# EasyEDA schematic SCH_Data Logging system Schematic Rev 1.0_2023-01-20.json

## Sheets
1 Sheet_1: TITLE: Sheet_1; REV: 1.0; Date: 2023-01-20; Sheet: 1/1; Drawn By: nicaltwasser; Company: Your Company
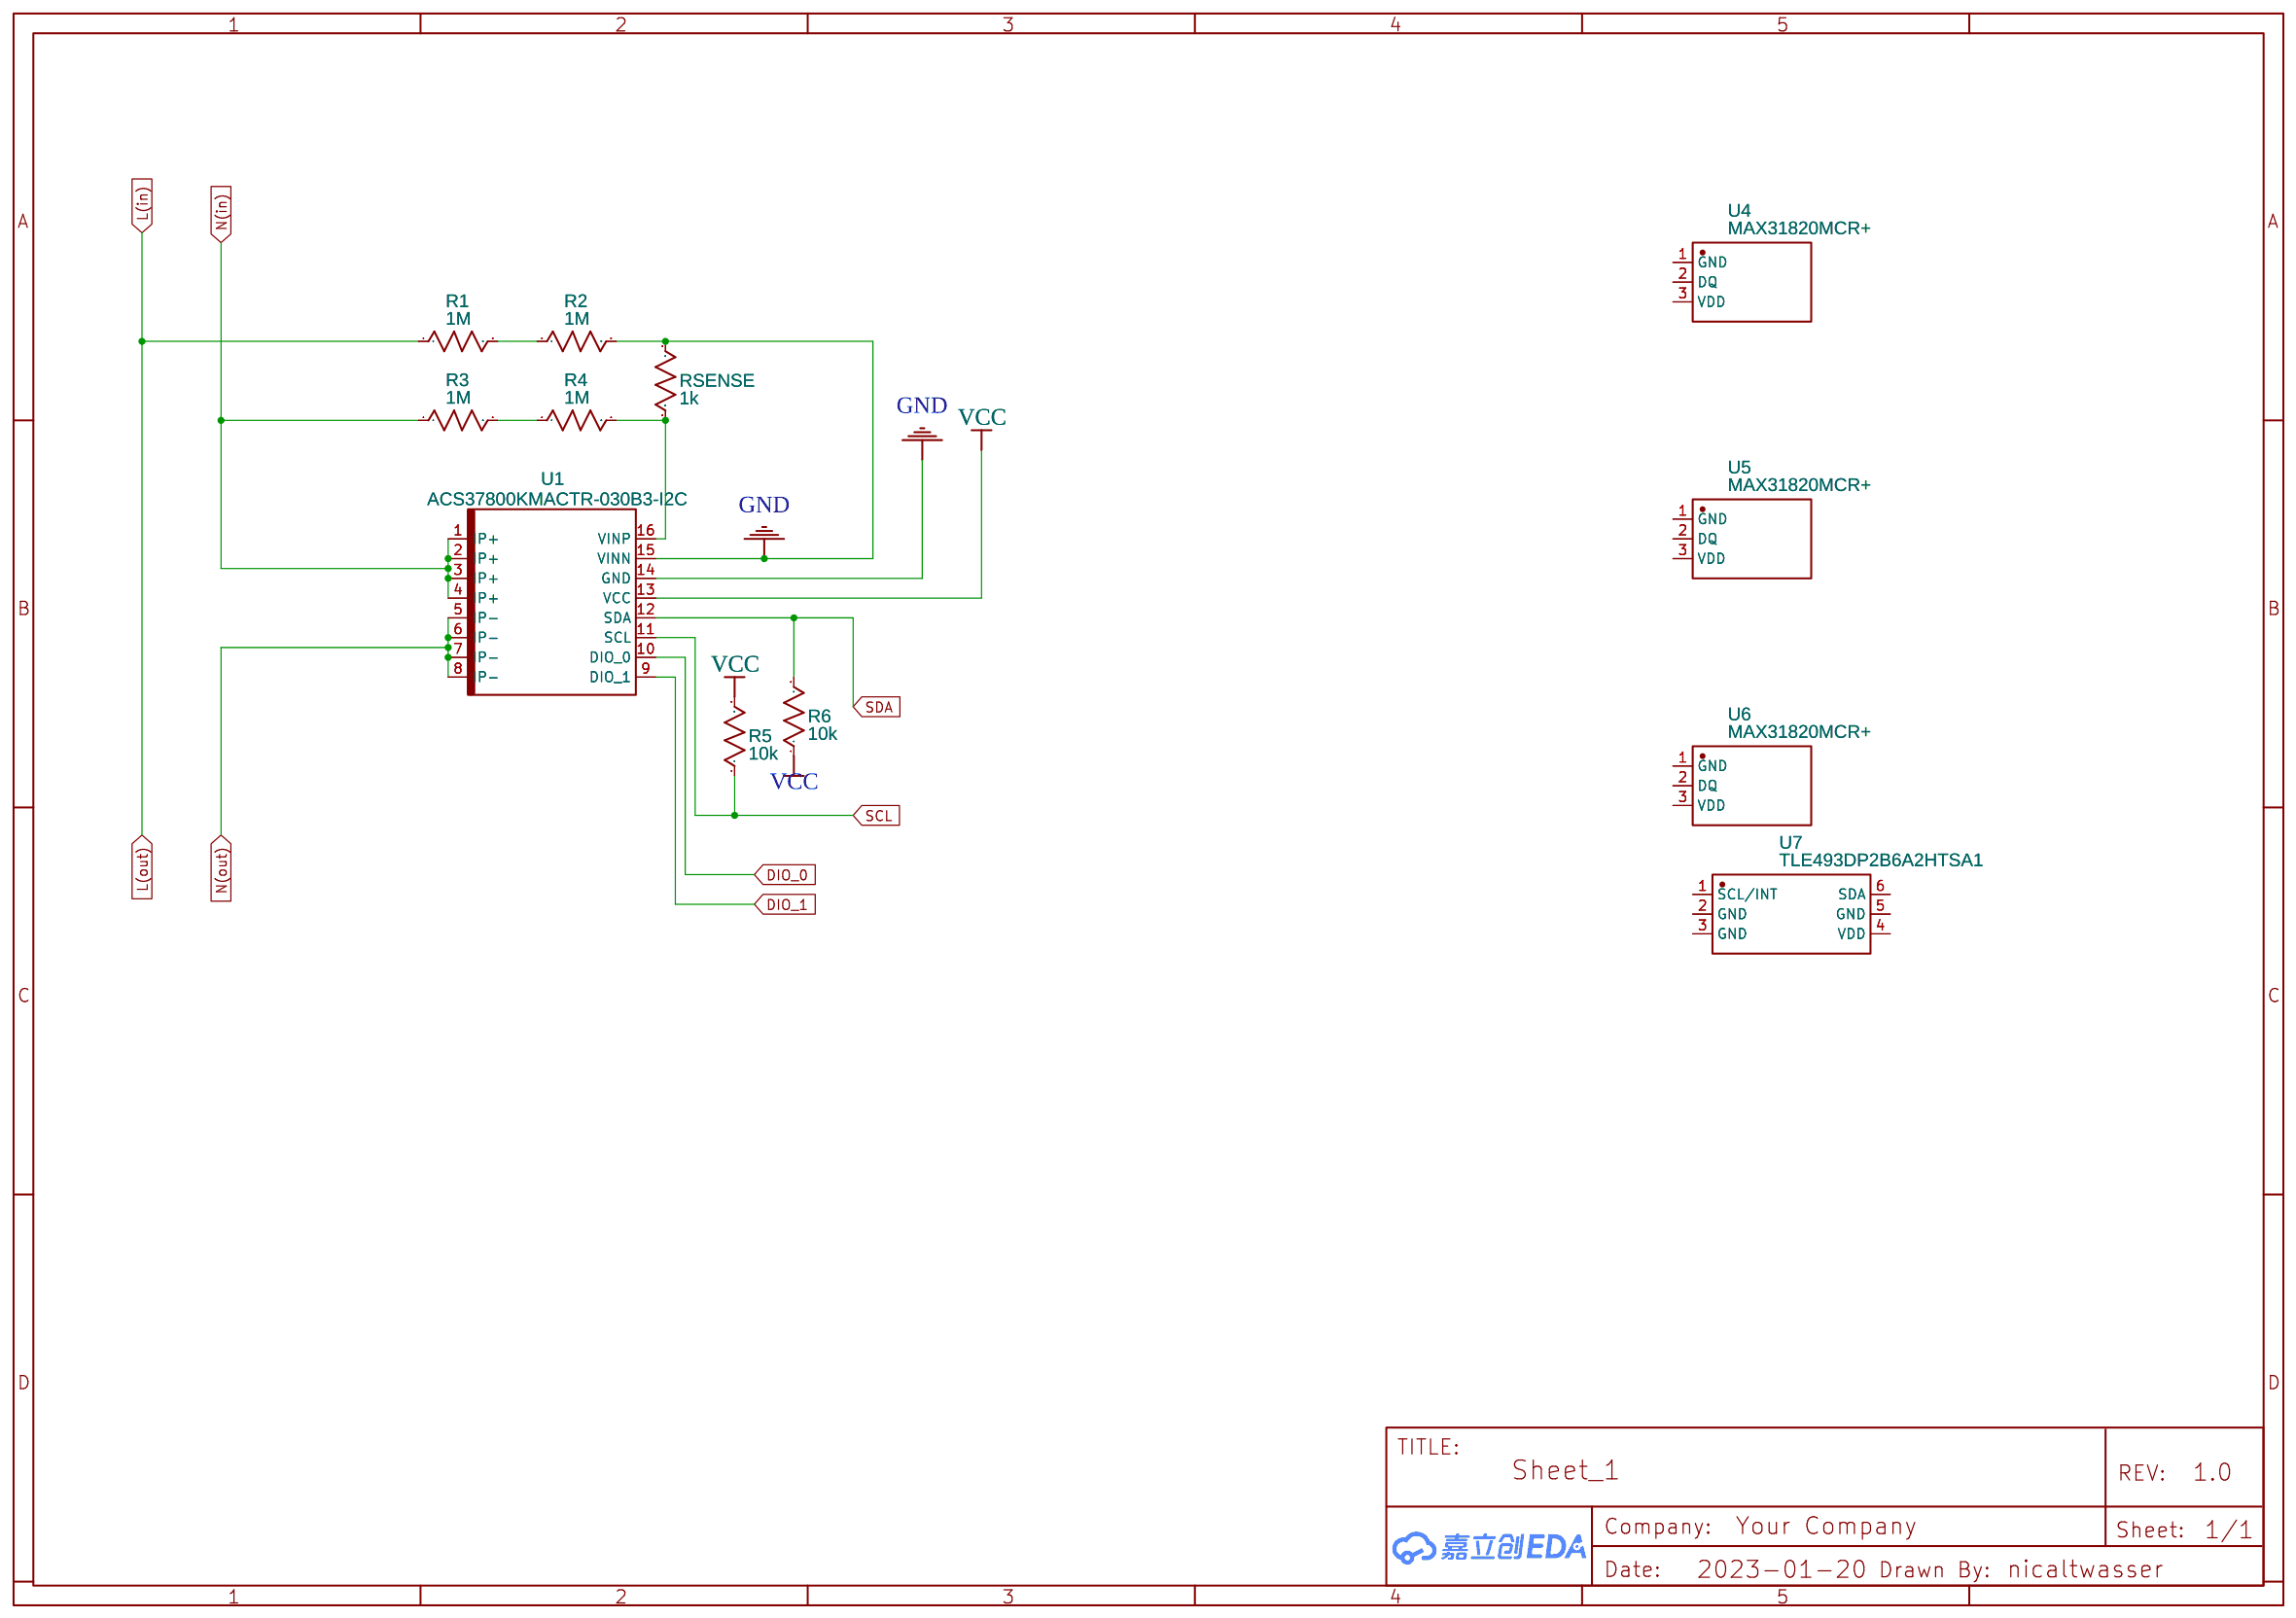
[diagram p0: Sheet_1]
2 Sheet_2: TITLE: Current and Voltage Sense
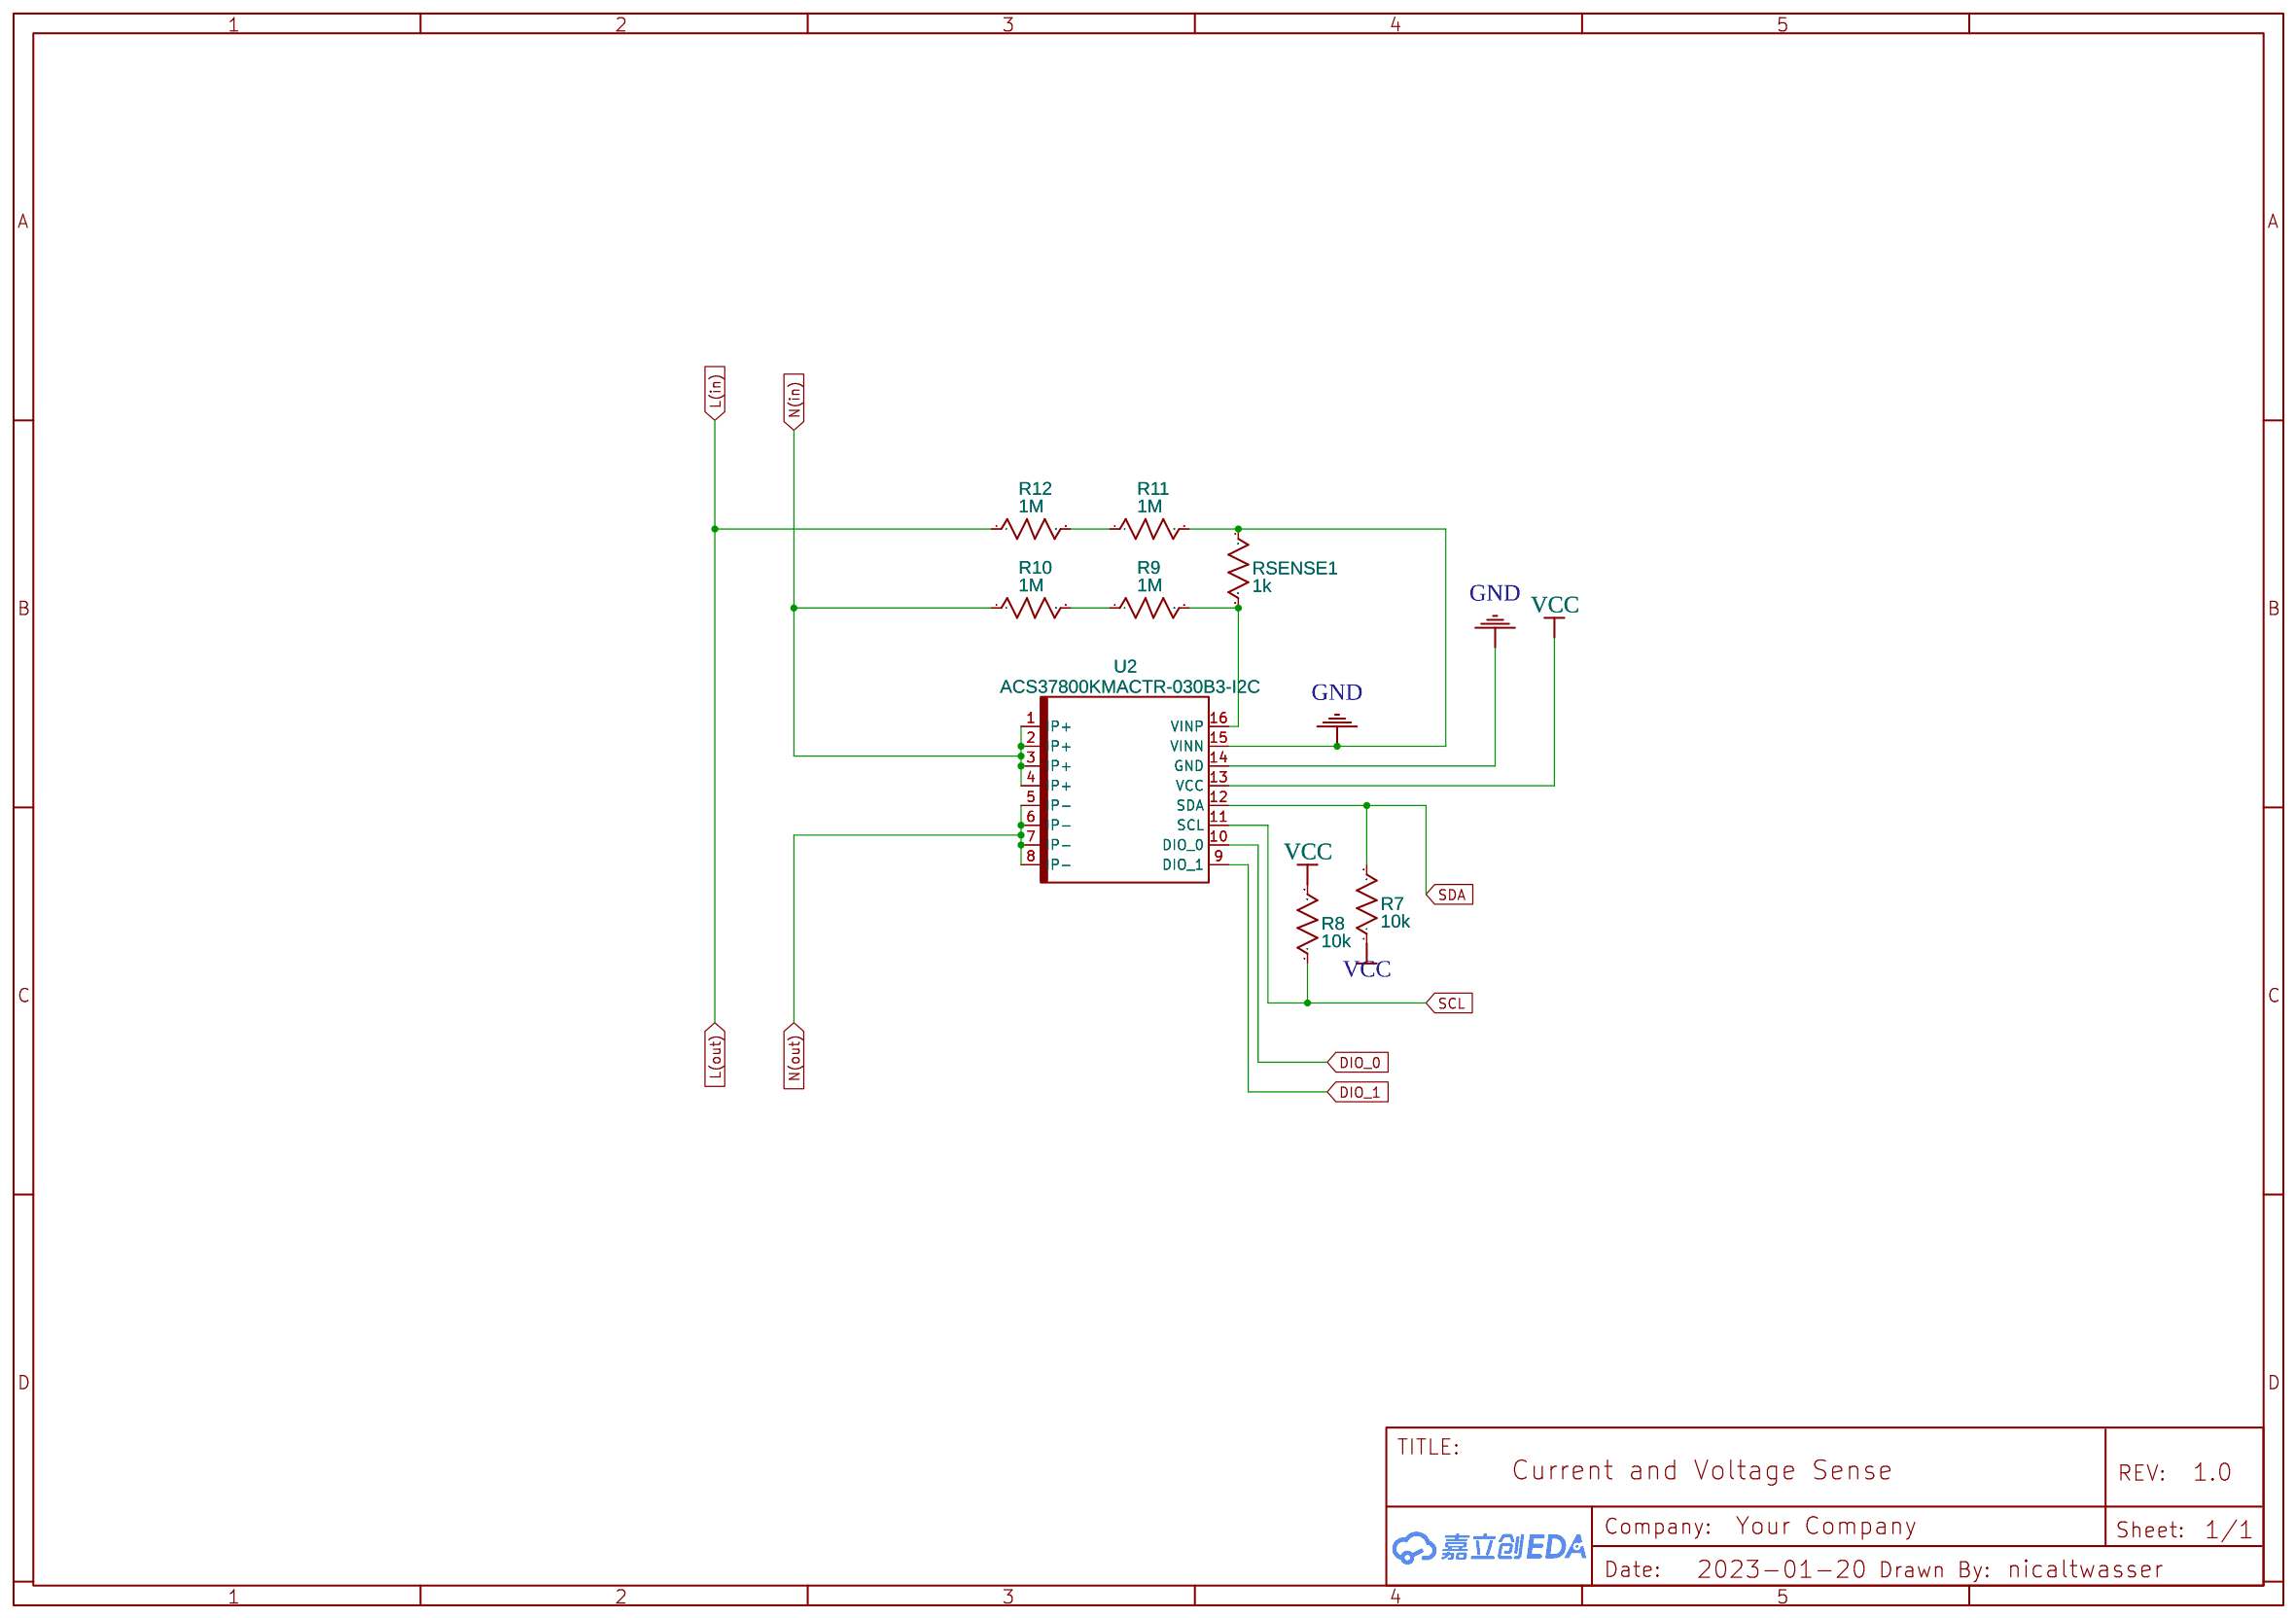
[diagram p1: Sheet_2]

## Parts
sheet Sheet_1
R1  1M  [R0603]
R2  1M  [R0603]
R3  1M  [R0603]
R4  1M  [R0603]
R5  10k  [R0603]
R6  10k  [R0603]
RSENSE  1k  [R0603]
U1  ACS37800KMACTR-030B3-I2C  [16-SOIC]
U4  MAX31820MCR+  [TO-92-3_L4.9-W3.7-P1.27-L]
U5  MAX31820MCR+  [TO-92-3_L4.9-W3.7-P1.27-L]
U6  MAX31820MCR+  [TO-92-3_L4.9-W3.7-P1.27-L]
U7  TLE493DP2B6A2HTSA1  [PG-TSOP-6_L2.9-W1.6-P0.95-LS2.8-BR]
sheet Sheet_2
R7  10k  [R0603]
R8  10k  [R0603]
R9  1M  [R0603]
R10  1M  [R0603]
R11  1M  [R0603]
R12  1M  [R0603]
RSENSE1  1k  [R0603]
U2  ACS37800KMACTR-030B3-I2C  [16-SOIC]

## Library data of the parts
R1-R12 RSENSE RSENSE1 = R_0603_US: Contributor: LCEDA_Lib
U1 U2 = ACS37800KMACTR-030B3-I2C: Manufacturer: ALLEGRO; Contributor: nitrostig
U4-U6 = MAX31820MCR+: Supplier: LCSC; Supplier Part: C190293; Manufacturer: MAXIM(美信); Contributor: LCSC; JLCPCB Part Class: Extended Part
U7 = TLE493DP2B6A2HTSA1: Supplier: LCSC; Supplier Part: C3716129; Manufacturer: Infineon(英飞凌); link: https://atta.szlcsc.comnull; Contributor: lcsc

## Nets
GND: R2.2 R11.2 RSENSE.1 RSENSE1.1 U1.14(GND) U1.15(VINN) U2.14(GND) U2.15(VINN)
VCC: R5.2 R6.1 R7.1 R8.2 U1.13(VCC) U2.13(VCC)
DIO_0: U1.10(DIO_0) U2.10(DIO_0)
DIO_1: U1.9(DIO_1) U2.9(DIO_1)
L(in): R1.1 R12.1
N(in): R3.1 R10.1 U1.1(IP+) U1.2(IP+) U1.3(IP+) U1.4(IP+) U2.1(IP+) U2.2(IP+) U2.3(IP+) U2.4(IP+)
N(out): U1.5(IP-) U1.6(IP-) U1.7(IP-) U1.8(IP-) U2.5(IP-) U2.6(IP-) U2.7(IP-) U2.8(IP-)
SCL: R5.1 R8.1 U1.11(SCL) U2.11(SCL)
SDA: R6.2 R7.2 U1.12(SDA) U2.12(SDA)
Net-(R1-2): R1.2 R2.1
Net-(R3-2): R3.2 R4.1
Net-(R4-2): R4.2 RSENSE.2 U1.16(VINP)
Net-(R9-1): R9.1 R10.2
Net-(R9-2): R9.2 RSENSE1.2 U2.16(VINP)
Net-(R11-1): R11.1 R12.2

Not connected (* = marked no-connect by the designer): U4 1(GND) 2(DQ) 3(VDD); U5 1(GND) 2(DQ) 3(VDD); U6 1(GND) 2(DQ) 3(VDD); U7 1(SCL/INT) 2(GND) 3(GND) 4(VDD) 5(GND) 6(SDA)
